# Altium schematic sheet Input.SchDoc
size A4
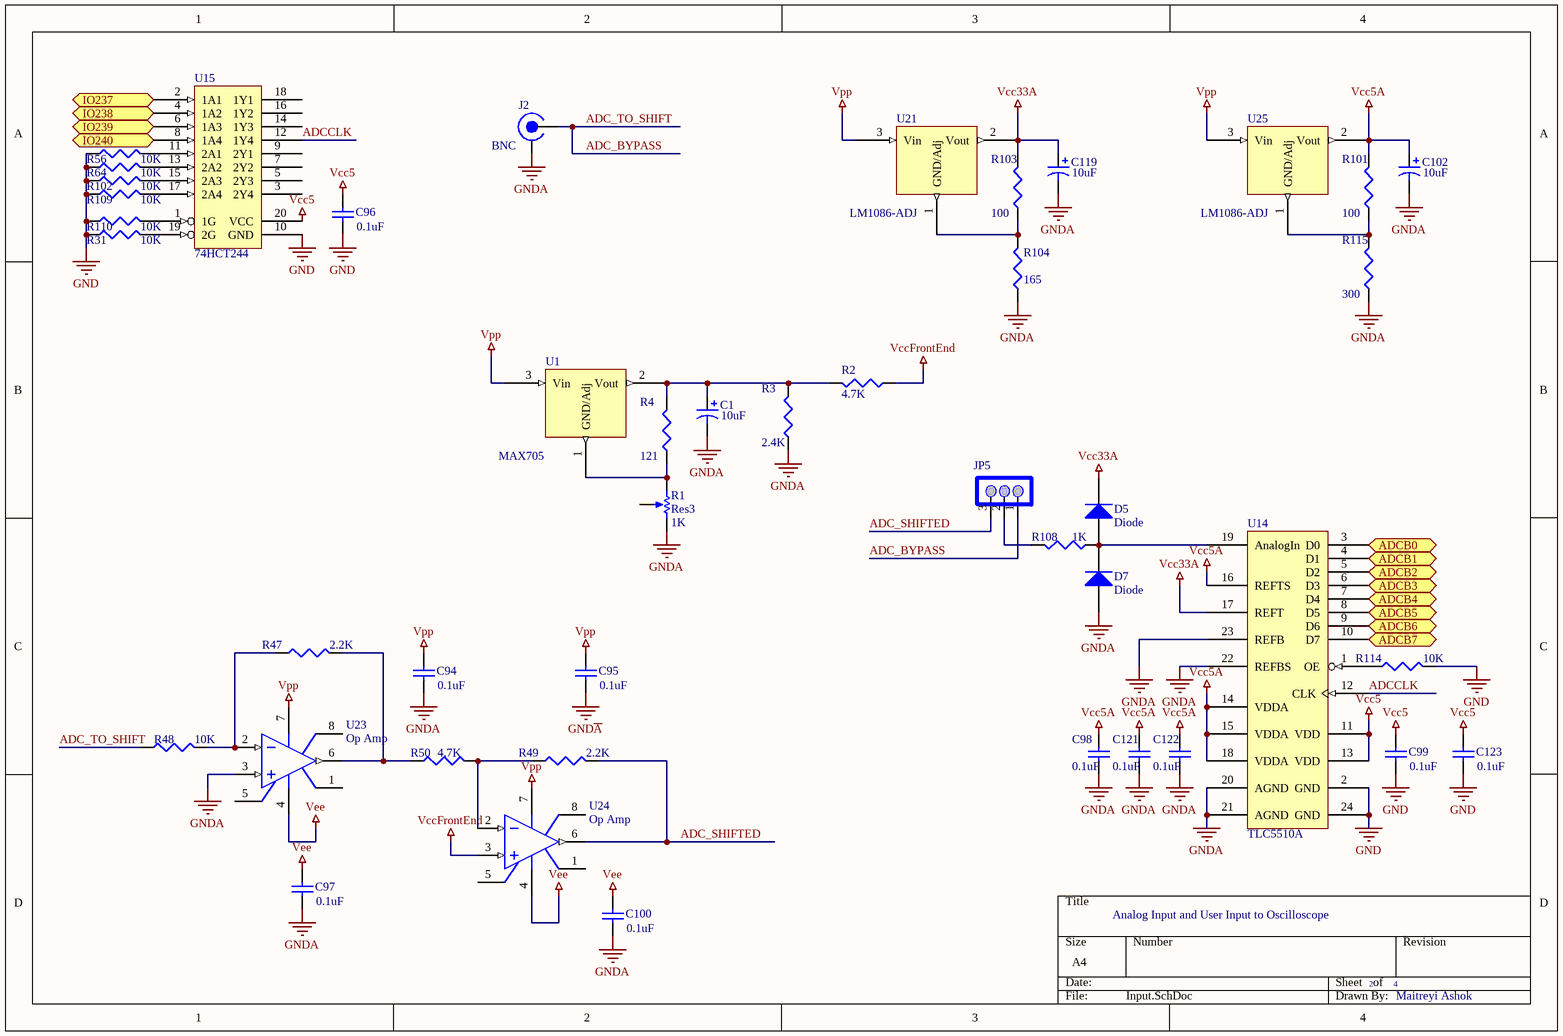
[diagram p0: Input.SchDoc]

## Parts
C1  value 10uF  [1608[0603]]  (hidden comment: Cap)
C94  value 0.1uF  [1608[0603]]  (hidden comment: Cap)
C95  value 0.1uF  [1608[0603]]  (hidden comment: Cap)
C96  value 0.1uF  [1608[0603]]  (hidden comment: Cap)
C97  value 0.1uF  [1608[0603]]  (hidden comment: Cap)
C98  value 0.1uF  [1608[0603]]  (hidden comment: Cap)
C99  value 0.1uF  [1608[0603]]  (hidden comment: Cap)
C100  value 0.1uF  [1608[0603]]  (hidden comment: Cap)
C102  value 10uF  [RB.1/.2]  (hidden comment: Cap Pol1)
C119  value 10uF  [RB.1/.2]  (hidden comment: Cap Pol1)
C121  value 0.1uF  [1608[0603]]  (hidden comment: Cap)
C122  value 0.1uF  [1608[0603]]  (hidden comment: Cap)
C123  value 0.1uF  [1608[0603]]  (hidden comment: Cap)
D5  Diode  [SMB]
D7  Diode  [SMB]
J2  BNC  [AMP31-5540]
JP5  CLK01  [HDR1X3]  (value not drawn)
R1  Res3  value 1K  [J1-0603]
R2  value 4.7K  [J1-0603]  (hidden comment: Res3)
R3  value 2.4K  [J1-0603]  (hidden comment: Res3)
R4  value 121  [J1-0603]  (hidden comment: Res3)
R31  value 10K  [J1-0603]  (hidden comment: Res3)
R47  value 2.2K  [J1-0603]  (hidden comment: 551)
R48  value 10K  [J1-0603]  (hidden comment: 551)
R49  value 2.2K  [J1-0603]  (hidden comment: 551)
R50  value 4.7K  [J1-0603]  (hidden comment: 551)
R56  value 10K  [J1-0603]  (hidden comment: Res3)
R64  value 10K  [J1-0603]  (hidden comment: Res3)
R101  value 100  [J1-0603]  (hidden comment: Res3)
R102  value 10K  [J1-0603]  (hidden comment: Res3)
R103  value 100  [J1-0603]  (hidden comment: Res3)
R104  value 165  [J1-0603]  (hidden comment: Res3)
R108  value 1K  [J1-0603]  (hidden comment: Res3)
R109  value 10K  [J1-0603]  (hidden comment: Res3)
R110  value 10K  [J1-0603]  (hidden comment: Res3)
R114  value 10K  [J1-0603]  (hidden comment: Res3)
R115  value 300  [J1-0603]  (hidden comment: Res3)
U1  MAX705  [TO-220]
U14  TLC5510A  [TSSOP24]
U15  74HCT244  [DIPS20]
U21  LM1086-ADJ  [TO-220V]
U23  Op Amp  [SO-8]
U24  Op Amp  [SO-8]
U25  LM1086-ADJ  [TO-220V]

## Ports
ADCB0 (out), ADCB1 (out), ADCB2 (out), ADCB3 (out), ADCB4 (out), ADCB5 (out), ADCB6 (out), ADCB7 (out), IO237 (in), IO238 (in), IO239 (in), IO240 (in)

## Nets
GND: C96.1 C99.1 C123.1 R31.1 R56.1 R64.1 R102.1 R109.1 R110.1 R114.2 U14.2(GND) U14.24(GND) U15.10(GND)
GNDA: C1.2 C94.1 C97.1 C98.1 C100.1 C102.2 C119.2 C121.1 C122.1 D7.1(A) J2.2(SHIELD) R1.2(BOT) R3.1 R104.1 R115.1 U14.20(AGND) U14.21(AGND) U14.22(REFBS) U14.23(REFB) U23.3(IN+)
GND~{A}: C95.1
VCC: C96.2 C99.2 C123.2 U14.11(VDD) U14.13(VDD) U15.20(VCC)  [also labelled Vcc5, VDD]
Vcc5A: C98.2 C102.1 C121.2 C122.2 R101.2 U14.14(VDDA) U14.15(VDDA) U14.16(REFTS) U14.18(VDDA) U25.2(Vout)
Vcc33A: C119.1 D5.2(K) R103.2 U14.17(REFT) U21.2(Vout)
VccFrontEnd: R2.1 U24.3(IN+)
Vee: C97.2 C100.2 U23.4(V-) U24.4(V-)
Vpp: C94.2 C95.2 U1.3(Vin) U21.3(Vin) U23.7(V+) U24.7(V+) U25.3(Vin)
ADC_BYPASS: J2.1(SIGNAL) JP5.1(J1) R48.1  [also labelled ADC_TO_SHIFT]
ADC_SHIFTED: JP5.3(J3) R49.2 U24.6(OUT)
ADCB0: U14.3(D0) ; port ADCB0
ADCB1: U14.4(D1) ; port ADCB1
ADCB2: U14.5(D2) ; port ADCB2
ADCB3: U14.6(D3) ; port ADCB3
ADCB4: U14.7(D4) ; port ADCB4
ADCB5: U14.8(D5) ; port ADCB5
ADCB6: U14.9(D6) ; port ADCB6
ADCB7: U14.10(D7) ; port ADCB7
ADCCLK: U14.12(CLK) U15.12(1Y4)
IO237: U15.2(1A1) ; port IO237
IO238: U15.4(1A2) ; port IO238
IO239: U15.6(1A3) ; port IO239
IO240: U15.8(1A4) ; port IO240
NetC1_1: C1.1 R2.2 R3.2 R4.2 U1.2(Vout)
NetD5_1: D5.1(A) D7.2(K) R108.1 U14.19(AnalogIn)
NetJP5_2: JP5.2(J2) R108.2
NetR1_1: R1.1(TOP) R4.1 U1.1(GND/Adj)
NetR31_2: R31.2 U15.19(2G)
NetR47_1: R47.1 R48.2 U23.2(IN-)
NetR47_2: R47.2 R50.1 U23.6(OUT)
NetR49_1: R49.1 R50.2 U24.2(IN-)
NetR56_2: R56.2 U15.11(2A1)
NetR64_2: R64.2 U15.13(2A2)
NetR101_1: R101.1 R115.2 U25.1(GND/Adj)
NetR102_2: R102.2 U15.15(2A3)
NetR103_1: R103.1 R104.2 U21.1(GND/Adj)
NetR109_2: R109.2 U15.17(2A4)
NetR110_2: R110.2 U15.1(1G)
NetR114_1: R114.1 U14.1(OE)

Not connected (* = marked no-connect by the designer): R1 3(TAP); U15 3(2Y4) 5(2Y3) 7(2Y2) 9(2Y1) 14(1Y3) 16(1Y2) 18(1Y1); U23 1(OS_NUL) 5(OS_NUL) 8(TAB); U24 1(OS_NUL) 5(OS_NUL) 8(TAB)

## Notes on the sheet
- Analog Input and User Input to Oscilloscope
- 2          4
- Maitreyi Ashok

## Library data of the parts
C1 C102 C119 = Cap Pol1: Polarized Capacitor (Radial); Published: 8-Jun-2000; LatestRevisionDate: 17-Jul-2002; LatestRevisionNote: Re-released for DXP Platform.; PackageReference: RB7.6-15; Publisher: Altium Limited; PackageDescription: Polarized Capacitor (Radial); 2 Leads
C94-C100 C121-C123 = Cap: Capacitor; Published: 8-Jun-2000; LatestRevisionDate: 17-Jul-2002; LatestRevisionNote: Re-released for DXP Platform.; PackageReference: RAD-0.3; Publisher: Altium Limited; PackageDescription: Radial Cap, Thru-Hole; 2 Leads; 0.3 in Pin Spacing
D5 D7 = Diode: LSM115JE3/TR13; Published: 8-Jun-2000; LatestRevisionDate: 17-Jul-2002; LatestRevisionNote: Re-released for DXP Platform.; PackageVersion: Sep-1996; PackageReference: SMC; Publisher: Altium Limited; PackageDescription: DO-214-AB/SMC; 2 C-Bend Leads; Body 7.9 x 5.9 mm, inc. leads (LxW); Code_JEDEC: DO-214-AB
J2 = BNC: BNC Connector
JP5 = JUMPER3SM
R1 = RPot: Potentiometer; Sim Note: Enter the Resistance value and the set point into parameter fields.; Set Position: 0.5; Published: 8-Jun-2000; LatestRevisionDate: 17-Jul-2002; LatestRevisionNote: Re-released for DXP Platform.; PackageReference: VR5; Publisher: Altium Limited; PackageDescription: Variable Resistor, Thru-Hole; 3 Leads
R2-R4 R31 R47-R50 R56 R64 R101-R104 R108-R110 R114 R115 = Res3: Resistor; Published: 8-Jun-2000; LatestRevisionDate: 29-May-2009; LatestRevisionNote: IPC-7351 Footprint Added.; PackageReference: J1-0603; Publisher: Altium Limited; PackageDescription: Chip Resistor
U1 U21 U25 = LM1086: 1.5A Low Dropout Positive Regulator
U14 = TLC5510: TI 8-bit A/D Converter
U15 = 74HCT244: Octal Buffer
U23 U24 = Op Amp: FET Operational Amplifier; Published: 8-Jun-2000; LatestRevisionDate: 17-Jul-2002; LatestRevisionNote: Re-released for DXP Platform.; DatasheetVersion: REV. B; PackageVersion: 1990; PackageReference: H-08A; Publisher: Altium Limited; PackageDescription: Can; 8 Leads; Pin Circle Dia. 5.08 mm; Lead Dia. 0.53 mm (max); ComponentLink1Description: Manufacturer Link; ComponentLink1URL: http://www.analog.com/